# Altium project LAB_Project_PCB.PrjPcb
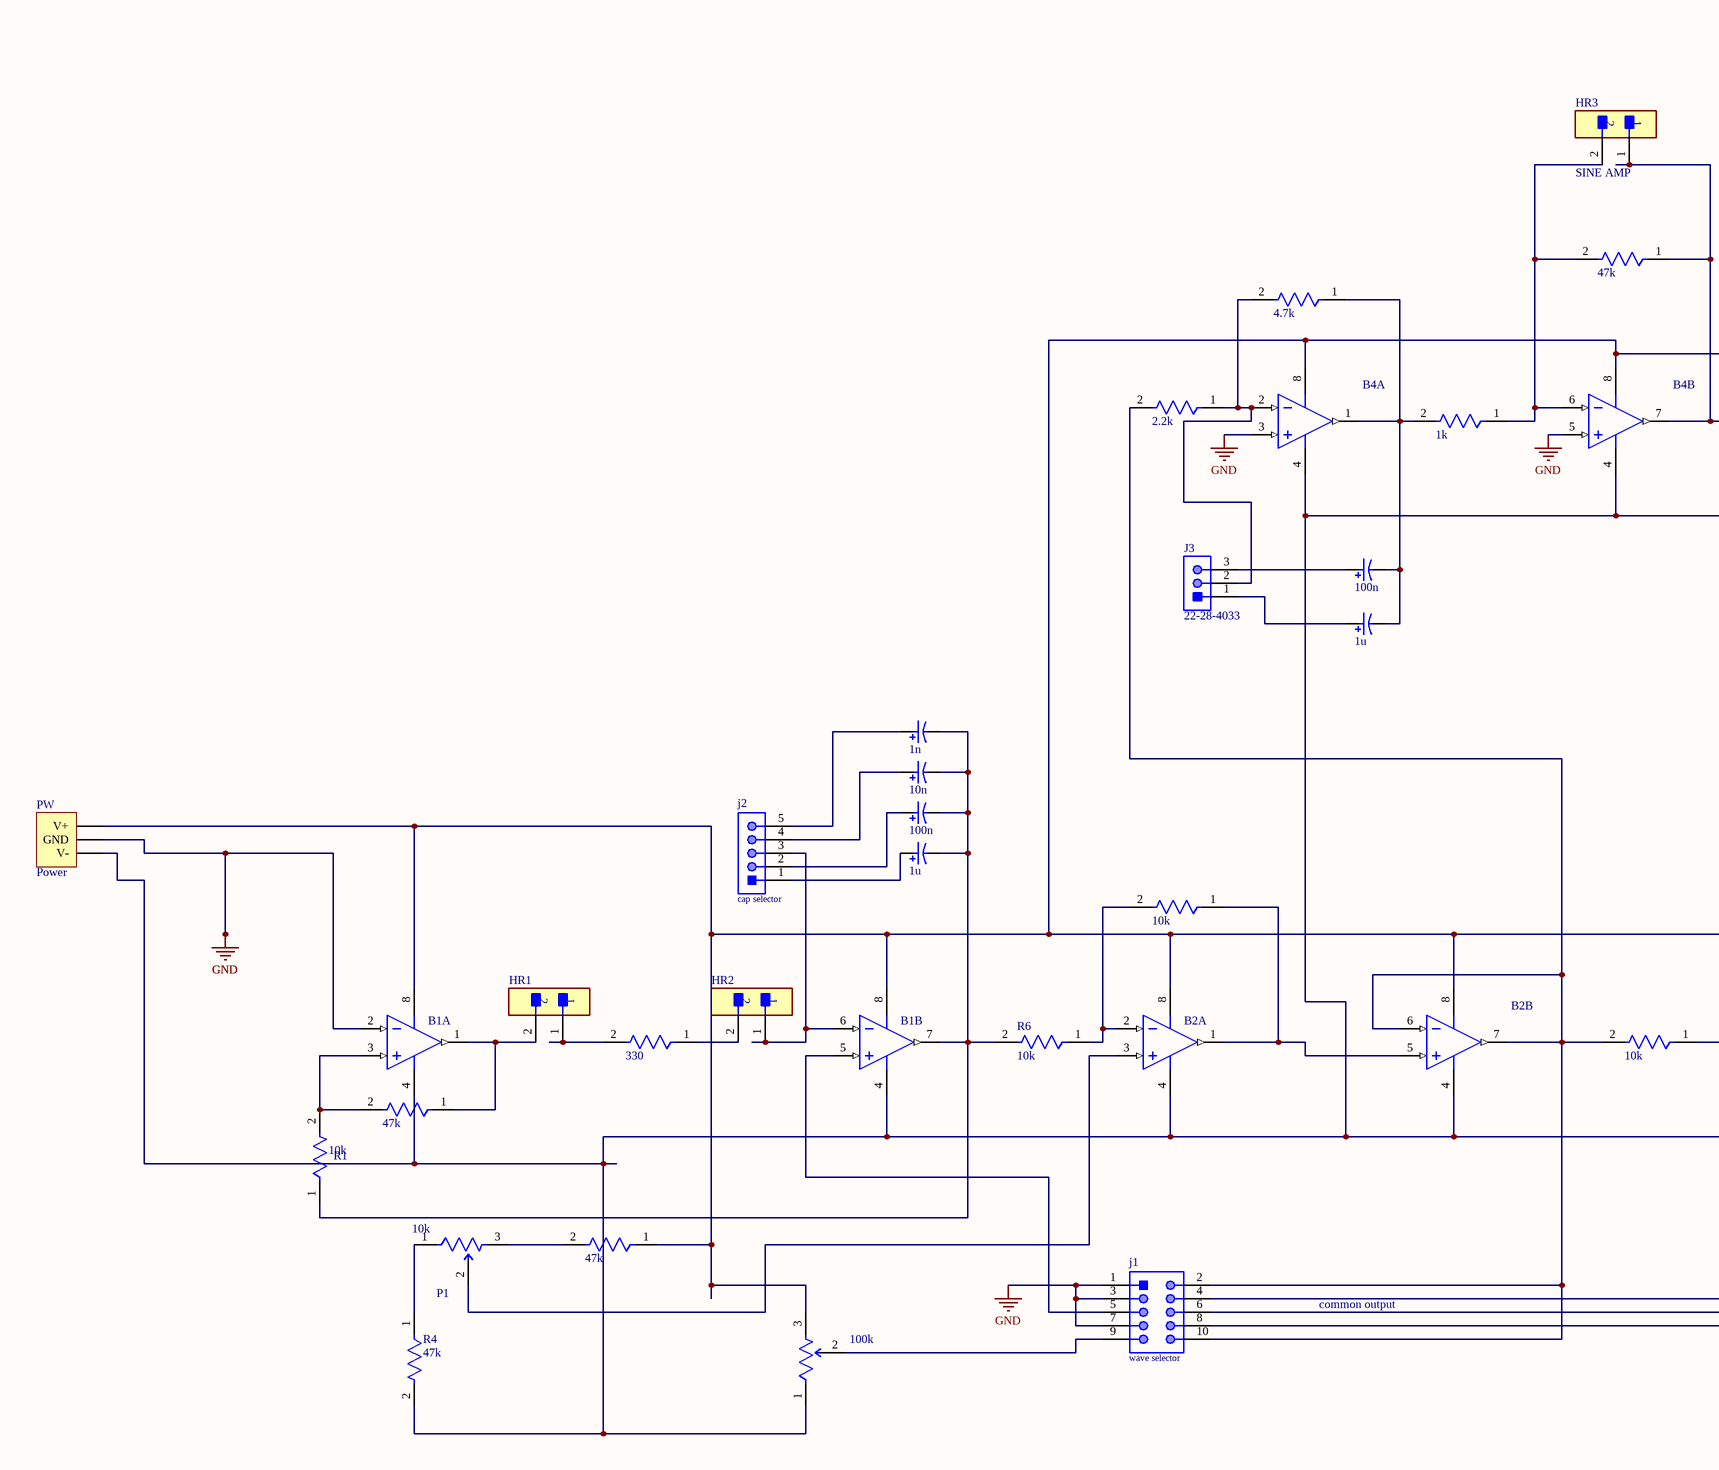
[diagram p0: Sheet1.SchDoc, left]
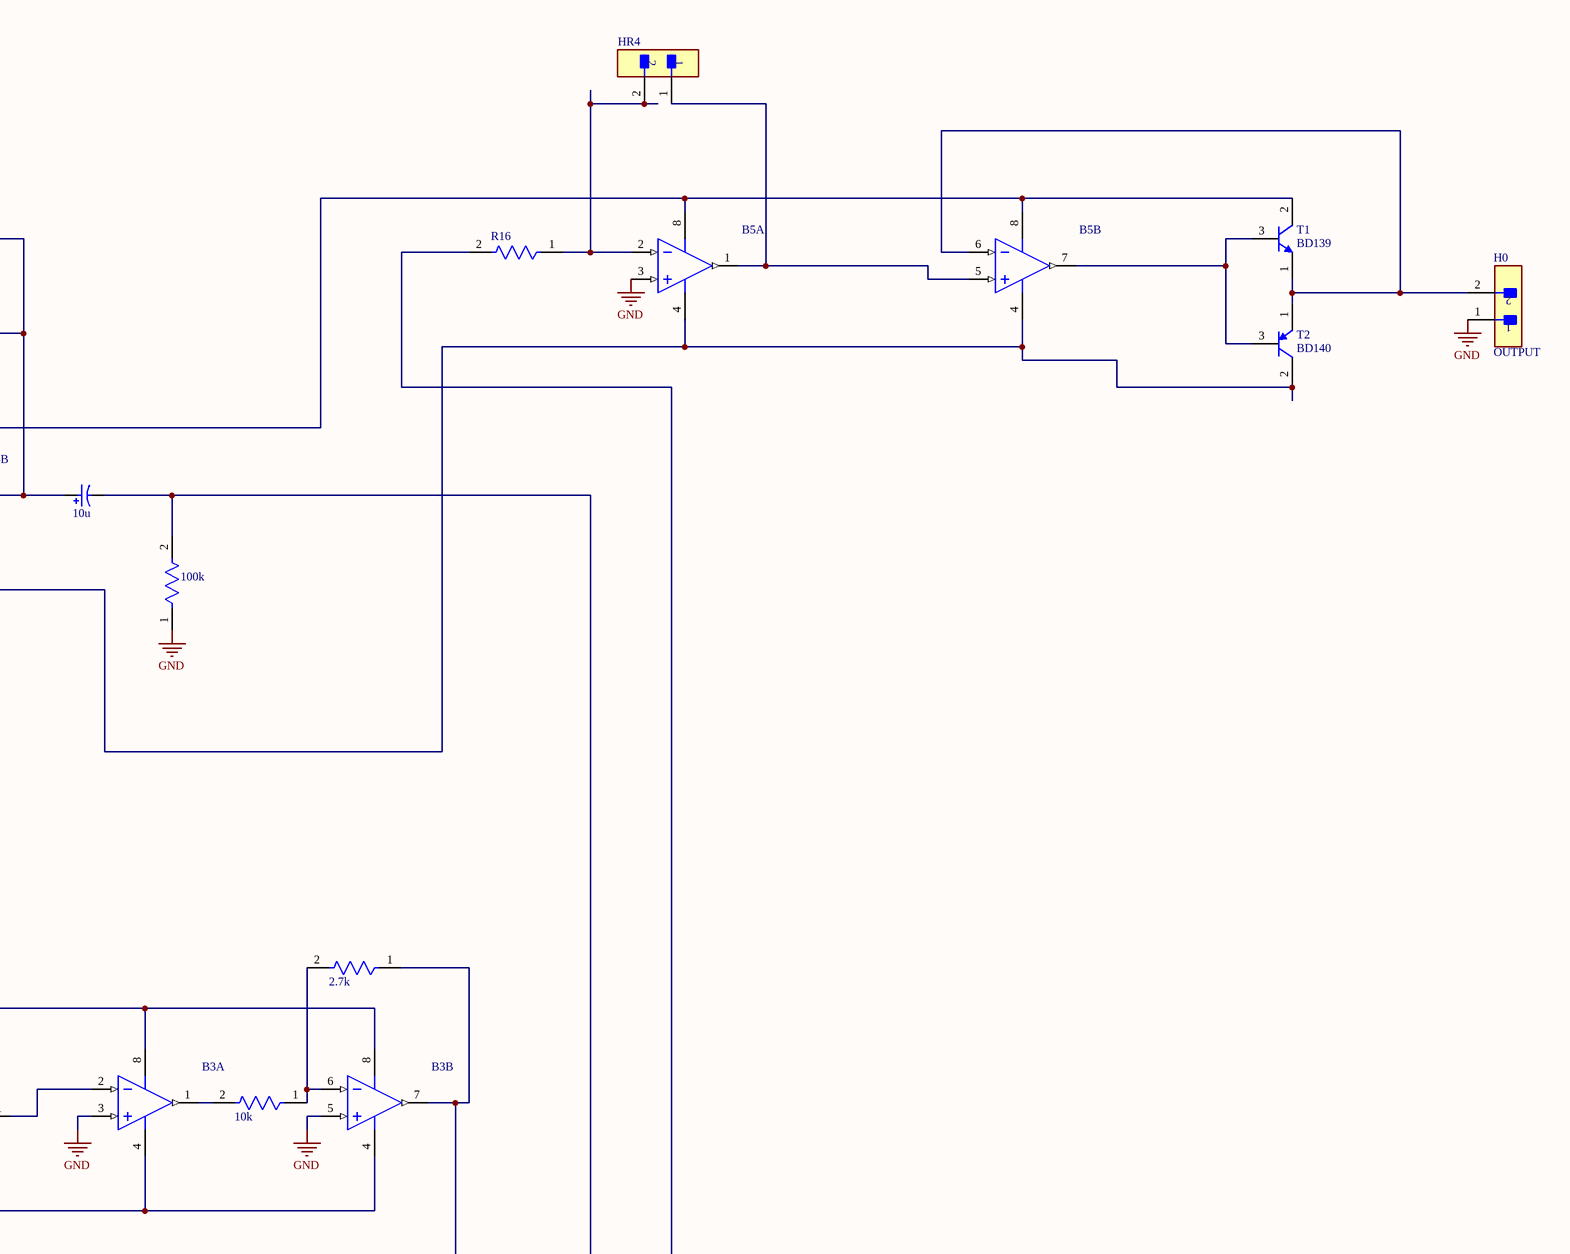
[diagram p1: Sheet1.SchDoc, right]
1 sheet, 41 parts. Net scope: global (net labels, ports and power ports of the same name join across sheets).
Board file: PCB1.PcbDoc

## Sheet Sheet1.SchDoc
size D; SheetNumber: 1; SheetTotal: 1

### Parts
B1  smitch trigger  [ADI-N-8]  (value not drawn)  (parts A,B of 2)
B2  comparator gain  [ADI-N-8]  (value not drawn)  (parts A,B of 2)
B3  AD826ANZ  [ADI-N-8]  (value not drawn)  (parts A,B of 2)
B4  AD826ANZ  [ADI-N-8]  (value not drawn)  (parts A,B of 2)
B5  AD826ANZ  [ADI-N-8]  (value not drawn)  (parts A,B of 2)
C1  1n  [CAPPR55-250-1120X630X1220]
C2  10n  [CAPPR55-250-1120X630X1220]
C3  100n  [CAPPR55-250-1120X630X1220]
C4  1u  [CAPPR55-250-1120X630X1220]
C5  100n  [CAPPR55-250-1120X630X1220]
C6  1u  [CAPPR55-250-1120X630X1220]
C7  10u  [CAPPR55-250-1120X630X1220]
H0  OUTPUT  [FP-TSW-102-07-L-S-MFG]
HR1  FREQ  [FP-TSW-102-07-L-S-MFG]  (value not drawn)
HR2  FREQ  [FP-TSW-102-07-L-S-MFG]  (value not drawn)
HR3  SINE AMP  [FP-TSW-102-07-L-S-MFG]
HR4  AMP  [FP-TSW-102-07-L-S-MFG]  (value not drawn)
j1  wave selector  [61301021121]
j2  cap selector  [61300511121]
J3  22-28-4033  [MOLX-22-28-4033_V]
P1  10k  [FP-3362P-1-503TLF-MFG]
P2  100k  [FP-3362P-1-503TLF-MFG]
PW  Power  [HDR1X3]
R1  10k  [FP-CF18-MFG]
R2  47k  [FP-CF18-MFG]
R3  330  [FP-CF18-MFG]
R4  47k  [FP-CF18-MFG]
R5  47k  [FP-CF18-MFG]
R6  10k  [FP-CF18-MFG]
R7  10k  [FP-CF18-MFG]
R8  10k  [FP-CF18-MFG]
R9  10k  [FP-CF18-MFG]
R10  2.7k  [FP-CF18-MFG]
R11  2.2k  [FP-CF18-MFG]
R12  4.7k  [FP-CF18-MFG]
R13  1k  [FP-CF18-MFG]
R14  47k  [FP-CF18-MFG]
R15  100k  [FP-CF18-MFG]
R16  10k  [FP-CF18-MFG]  (value not drawn)
T1  BD139  [ONSC-TO-225-3-77-09]
T2  BD140  [ONSC-TO-225-3-77-09]

### Nets
GND: B1.2(-IN_1) B3.3(+IN_1) B3.5(+IN_2) B4.3(+IN_1) B4.5(+IN_2) B5.3(+IN_1) H0.1 j1.1 j1.3 j1.7 PW.2(GND) R15.1
NetB1_1: B1.1(OUT_1) HR1.2 R2.1
NetB1_3: B1.3(+IN_1) R1.2 R2.2
NetB1_4: B1.4(-V) B2.4(-V) B3.4(-V) B4.4(-V) B5.4(-V) P2.1(CCW) PW.3(V-) R4.2 T2.2(C)
NetB1_5: B1.5(+IN_2) j1.5
NetB1_6: B1.6(-IN_2) HR2.1 j2.3
NetB1_7: B1.7(OUT_2) C1.2 C2.2 C3.2 C4.2 R1.1 R6.2
NetB1_8: B1.8(+V) B2.8(+V) B3.8(+V) B4.8(+V) B5.8(+V) P2.3(CW) PW.1(V+) R5.1 T1.2(C)
NetB2_1: B2.1(OUT_1) B2.5(+IN_2) R7.1
NetB2_2: B2.2(-IN_1) R6.1 R7.2
NetB2_3: B2.3(+IN_1) P1.2(WIPER)
NetB2_6: B2.6(-IN_2) B2.7(OUT_2) j1.2 j1.10 R8.2 R11.2
NetB3_1: B3.1(OUT_1) R9.2
NetB3_2: B3.2(-IN_1) R8.1
NetB3_6: B3.6(-IN_2) R9.1 R10.2
NetB3_7: B3.7(OUT_2) j1.4 R10.1
NetB4_1: B4.1(OUT_1) C5.2 C6.2 R12.1 R13.2
NetB4_2: B4.2(-IN_1) J3.2 R11.1 R12.2
NetB4_6: B4.6(-IN_2) HR3.2 R13.1 R14.2
NetB4_7: B4.7(OUT_2) C7.1 HR3.1 R14.1
NetB5_1: B5.1(OUT_1) B5.5(+IN_2) HR4.1
NetB5_2: B5.2(-IN_1) HR4.2 R16.1
NetB5_6: B5.6(-IN_2) H0.2 T1.1(E) T2.1(E)
NetB5_7: B5.7(OUT_2) T1.3(B) T2.3(B)
NetC1_1: C1.1 j2.5
NetC2_1: C2.1 j2.4
NetC3_1: C3.1 j2.2
NetC4_1: C4.1 j2.1
NetC5_1: C5.1 J3.3
NetC6_1: C6.1 J3.1
NetC7_2: C7.2 j1.8 R15.2
NetHR1_1: HR1.1 R3.2
NetHR2_2: HR2.2 R3.1
Netj1_6: j1.6 R16.2
Netj1_9: j1.9 P2.2(WIPER)
NetP1_1: P1.1(CCW) R4.1
NetP1_3: P1.3(CW) R5.2

### Notes on the sheet
- common output

### Library data of the parts
B1 B2 = CMP-0384-00249-1: Double Channel Low Power Operational Amplifier, 50 MHz BW, 350 V/us SR, Industrial, 8-pin DIP (N-8), Tube; Manufacturer: Analog Devices; PartNumber: AD826ANZ; Generic Part Number: AD826; V Span Max: 36V; Iq/Amp: 7.5mA; Input Offset Voltage: 500uV; Input Bias Current: 3.3uA; Amplifiers Per Package: 2; Small Signal Bandwidth: 50MHz; V Span Min: 5V; ComponentLink3URL: http:/www.analog.com/static/imported-files/packages/PKG_PDF/PDIP(N)/N_8.pdf; ComponentLink1URL: http://www.analog.com/en/index.html; PackageVersion: 070606-A; Slew Rate: 350V/us; ComponentLink1Description: Manufacturer URL; Mounting Technology: Through Hole; ComponentLink2Description: Datasheet; DatasheetVersion: Rev. C; ComponentLink3Description: Package Specification; PackageReference: N-8; PackageDescription: 8-Pin Plastic Dual In-Line Package, Row spacing 7.62 mm, Pitch 2.54 mm; ComponentLink2URL: http://www.analog.com/static/imported-files/data_sheets/AD826.pdf; Code_JEDEC: MS-001
B3-B5 = CMP-0384-00249-1: Double Channel Low Power Operational Amplifier, 50 MHz BW, 350 V/us SR, Industrial, 8-pin DIP (N-8), Tube; Manufacturer: Analog Devices; Generic Part Number: AD826; V Span Max: 36V; Iq/Amp: 7.5mA; Input Offset Voltage: 500uV; Input Bias Current: 3.3uA; Amplifiers Per Package: 2; Small Signal Bandwidth: 50MHz; V Span Min: 5V; ComponentLink3URL: http:/www.analog.com/static/imported-files/packages/PKG_PDF/PDIP(N)/N_8.pdf; ComponentLink1URL: http://www.analog.com/en/index.html; PackageVersion: 070606-A; Slew Rate: 350V/us; ComponentLink1Description: Manufacturer URL; Mounting Technology: Through Hole; ComponentLink2Description: Datasheet; DatasheetVersion: Rev. C; PartNumber: AD826ANZ; ComponentLink3Description: Package Specification; PackageReference: N-8; PackageDescription: 8-Pin Plastic Dual In-Line Package, Row spacing 7.62 mm, Pitch 2.54 mm; ComponentLink2URL: http://www.analog.com/static/imported-files/data_sheets/AD826.pdf; Code_JEDEC: MS-001
C1-C7 = CMP-1665-00015-4: Aluminum Electrolytic Capacitor (Radial Lead Type), 100 uF, 35 V, -40 to 85 degC, 2-Pin THD, RoHS, Bulk; Manufacturer: Panasonic; Voltage Rating: 35 V; PackageReference: Radial; ComponentLink2URL: http://industrial.panasonic.com/cdbs/www-data/pdf/RDF0000/ABA0000C1047.pdf; DatasheetVersion: 03/2016; REACH SVHC: No SVHC; Mounting Technology: Through Hole; ComponentLink2Description: Datasheet; Packaging: Bulk; Lead Pitch: 2.5 mm; Height: 11.2 mm; Pins: 2; RoHSCompliant: true; Mount: Through Hole; Package Quantity: 200; Min Operating Temperature: -40 degC; Max Operating Temperature: 85 degC; PackageDescription: 2-Pin Through Hole Device, Dia 6.3 mm, Body Length 11.2 mm; ComponentLink1Description: Manufacturer URL; Length: 11.2 mm; ComponentLink1URL: http://www.panasonic.com/
H0 HR1-HR4 = CMP-02766-001428-1: CONN HEADER VERT 2POS 2.54MM; Voltage Rating: 550V; Current Rating: 7.6A; Gender: Male; Number of Contacts: 2; Connector Type: Male Pin; Radiation Hardening: No; Orientation: Straight; Contact Plating: Gold; Max Operating Temperature: 125°C; Mount: Through Hole; Package Quantity: 1; Number of Rows: 1; Housing Material: Polyester; RoHS Compliant: Yes; Length: 5.08mm; Max Voltage Rating (AC): 550V; Pitch: 2.54mm; Packaging: Bulk; Depth: 2.54mm; Termination: Solder; Min Operating Temperature: -55°C; Housing Color: Black; Lead Free: Lead Free; Color: Black; Number of Positions: 2; Width: 2.54mm; Max Current Rating: 7.6A; REACH SVHC: No SVHC; Contact Material: Bronze; Contact Mating Length: 0.23inch; Series: TSW; Contact Type: Male Pin
j1 = CMP-1502-01084-1: THT Vertical Pin Header WR-PHD, Pitch 2.54 mm, Dual Row, 10 pins; Manufacturer: Wurth Elektronik; Working Voltage: 250VAC; Pitch: 2.54mm; Contact Resistance: 20mOhm; Gender: Male; Rated Current: 3A; Withstanding Voltage: 500VAC; Pin Number: 10; Operating Temperature: -40to105degC; Mounting Technology: THT; Publisher: WurthElektronik; Manufacturer URL: http://www.we-online.de; Part Number: 61301021121; Row Number: Dual; Packaging: Bag; Orientation: Vertical; Package Reference: 61301021121; Datasheet URL: https://katalog.we-online.de/em/datasheet/6130xx21121.pdf
j2 = CMP-1502-01068-1: THT Vertical Pin Header WR-PHD, Pitch 2.54 mm, Single Row, 5 pins; Manufacturer: Wurth Elektronik; Pin Number: 5; Contact Resistance: 20mOhm; Working Voltage: 250VAC; Pitch: 2.54mm; Withstanding Voltage: 500VAC; Rated Current: 3A; Gender: Male; Datasheet URL: https://katalog.we-online.de/em/datasheet/6130xx11121.pdf; Orientation: Vertical; Mounting Technology: THT; Row Number: Single; Package Reference: 61300511121; Publisher: WurthElektronik; Part Number: 61300511121; Packaging: Bag; Manufacturer URL: http://www.we-online.de; Operating Temperature: -40to105degC
J3 = CMP-1676-00001-5: Male Header, Pitch 2.54 mm, 1 x 3 Position, Height 8.38 mm, Tail Length 3.18 mm, RoHS, Bulk; Manufacturer: Molex; Rows: 1; Voltage Rating: 250 V; Current Rating: 4 A; Min Operating Temperature: 0 degC; Lead Pitch: 0.1 inch; Packaging: Bulk; Contact Finish: Gold; RoHSCompliant: true; Contact Material: Brass; PackageReference: 22-28-4033; REACH SVHC: Unknown; PackageDescription: Male Header, Pitch 2.54 mm, 1 x 3 Position, Height 8.38 mm, Tail Length 3.18 mm; ComponentLink2URL: http://www.molex.com/pdm_docs/sd/022284033_sd.pdf; Height: 8.38 mm; Mounting Technology: Through Hole; ComponentLink1Description: Manufacturer URL; Length: 7.62 mm; Mount: Through Hole; DatasheetVersion: Rev. G, 01/2012; Max Operating Temperature: 75 degC; ComponentLink2Description: Datasheet; Colour: Black; Pins: 3; Contact Plating: Gold; Package Quantity: 1; ComponentLink1URL: http://www.molex.com/
P1 P2 = CMP-07234-000028-1: TRIMMER 50K OHM 0.5W PC PIN TOP; Temperature Coefficient: 100ppm/°C; Voltage Rating (DC): 300V; Resistance: 50kR; Power Rating: 500mW; Tolerance: 10%; Number of Turns: 1; Series: Trimpot® 3362 - Sealed; Military Standard: Not; Termination: Pin; Technology: CERMET; Depth: 7.04mm; RoHS Compliant: Yes; Max Operating Temperature: 125°C; Lead Free: Lead Free; Max Power Dissipation: 500mW; REACH SVHC: No SVHC; Min Operating Temperature: -55°C; Resistor Type: Cermet; Height: 0.185inch; Width: 4.7mm; Mount: Through Hole; Weight: 0.02oz; Length: 6.6mm; Resistance Tolerance: 10%; Package Quantity: 50; Radiation Hardening: No; Packaging: Rail/Tube
PW = Header 3: Header, 3-Pin; LatestRevisionDate: 17-Jul-2002; LatestRevisionNote: Re-released for DXP Platform.; Publisher: Altium Limited
R1 R4-R9 R11-R16 = CMP-26528-000002-1: RES 10K OHM 1/8W 5% CF AXIAL; Manufacturer Part Number: CF18JT10K0; Manufacturer: Stackpole Electronics; Power Rating: 0.125W; Temperature Coefficient: 0-500ppm/°C; Resistance: 10kΩ; Voltage Rating: 250V; Value: 10kΩ; Temperature: -55°C to +155°C; Height: 2mm; Lead Free: Yes; Automotive: No; Device Class L2: Resistors; Package: CF18; Series: CF; ComponentLink2Description: Datasheet; Ipc Land Pattern Name: RESAD656W65L360D200; Temperature Range High: +155°C; RoHS: TRUE; Device Class L3: Through-Hole Resistors; Temperature Range Low: -55°C; Device Class L1: Passive Components; Category: Res; Octopart: https://octopart.com/cf18jt10k0-stackpole+electronics-19205642; Composition: Carbon Film; Digikey Description: RES 10K OHM 1/8W 5% CF AXIAL; ComponentLink2URL: http://www.seielect.com/Catalog/SEI-CF_CFM.pdf; Tolerance: 5%
R2 R3 R10 = CMP-26528-000002-1: RES 10K OHM 1/8W 5% CF AXIAL; Manufacturer Part Number: CF18JT10K0; Manufacturer: Stackpole Electronics; Power Rating: 0.125W; Temperature Coefficient: 0-500ppm/°C; Voltage Rating: 250V; Temperature: -55°C to +155°C; Height: 2mm; Lead Free: Yes; Automotive: No; Device Class L2: Resistors; Package: CF18; Series: CF; ComponentLink2Description: Datasheet; Ipc Land Pattern Name: RESAD656W65L360D200; Temperature Range High: +155°C; RoHS: TRUE; Device Class L3: Through-Hole Resistors; Temperature Range Low: -55°C; Device Class L1: Passive Components; Category: Res; Octopart: https://octopart.com/cf18jt10k0-stackpole+electronics-19205642; Composition: Carbon Film; Digikey Description: RES 10K OHM 1/8W 5% CF AXIAL; ComponentLink2URL: http://www.seielect.com/Catalog/SEI-CF_CFM.pdf; Tolerance: 5%
  R2: Resistance: 47k; Value: 47k
  R3: Resistance: 330; Value: 330
  R10: Resistance: 2.7k; Value: 2.7k
T1 = CMP-1048-01271-1: Plastic Medium-Power Silicon NPN Transistor, 3-Pin TO-225, Bulk Box; Manufacturer: On Semiconductor; IC Continuous (A): 1.5; Packing: Bulk Box; ComponentLink2URL: http://www.onsemi.com/pub_link/Collateral/BD135-D.PDF; ComponentLink2Description: Datasheet; ComponentLink1URL: http://www.onsemi.com/; Polarity: NPN; PartNumber: BD139; ComponentLink1Description: Manufacturer URL; RoHS: FALSE; ComponentLink3Description: Package Specification; PackageReference: TO-225-3-77-09; Mounting Technology: Through Hole; DatasheetVersion: Rev. 16; PackageDescription: 3-Pin Flange Mount, Vertical Straight Lead, Body 7.6 x 2.7 mm, Pitch 2.29 mm; PackageVersion: Rev. AC, 12/2013; ComponentLink3URL: http://www.onsemi.com/pub_link/Collateral/77-09.PDF
T2 = CMP-1048-00039-1: Plastic Medium-Power Silicon PNP Transistor, 3-Pin TO-225, Bulk Box; Manufacturer: On Semiconductor; IC Continuous (A): 1.5; PartNumber: BD140; ComponentLink1Description: Manufacturer URL; RoHS: FALSE; ComponentLink1URL: http://www.onsemi.com/; DatasheetVersion: Rev. 15; ComponentLink2URL: http://www.onsemi.com/pub_link/Collateral/BD136-D.PDF; ComponentLink3Description: Package Specification; Packing: Bulk Box; PackageVersion: Rev. AC, 12/2013; ComponentLink3URL: http://www.onsemi.com/pub_link/Collateral/77-09.PDF; PackageDescription: 3-Pin Flange Mount, Vertical Straight Lead, Body 7.6 x 2.7 mm, Pitch 2.29 mm; Mounting Technology: Through Hole; PackageReference: TO-225-3-77-09; ComponentLink2Description: Datasheet; Polarity: PNP